# EasyEDA Pro project lune-v6-rev3.2.eprj, board PCB1_1
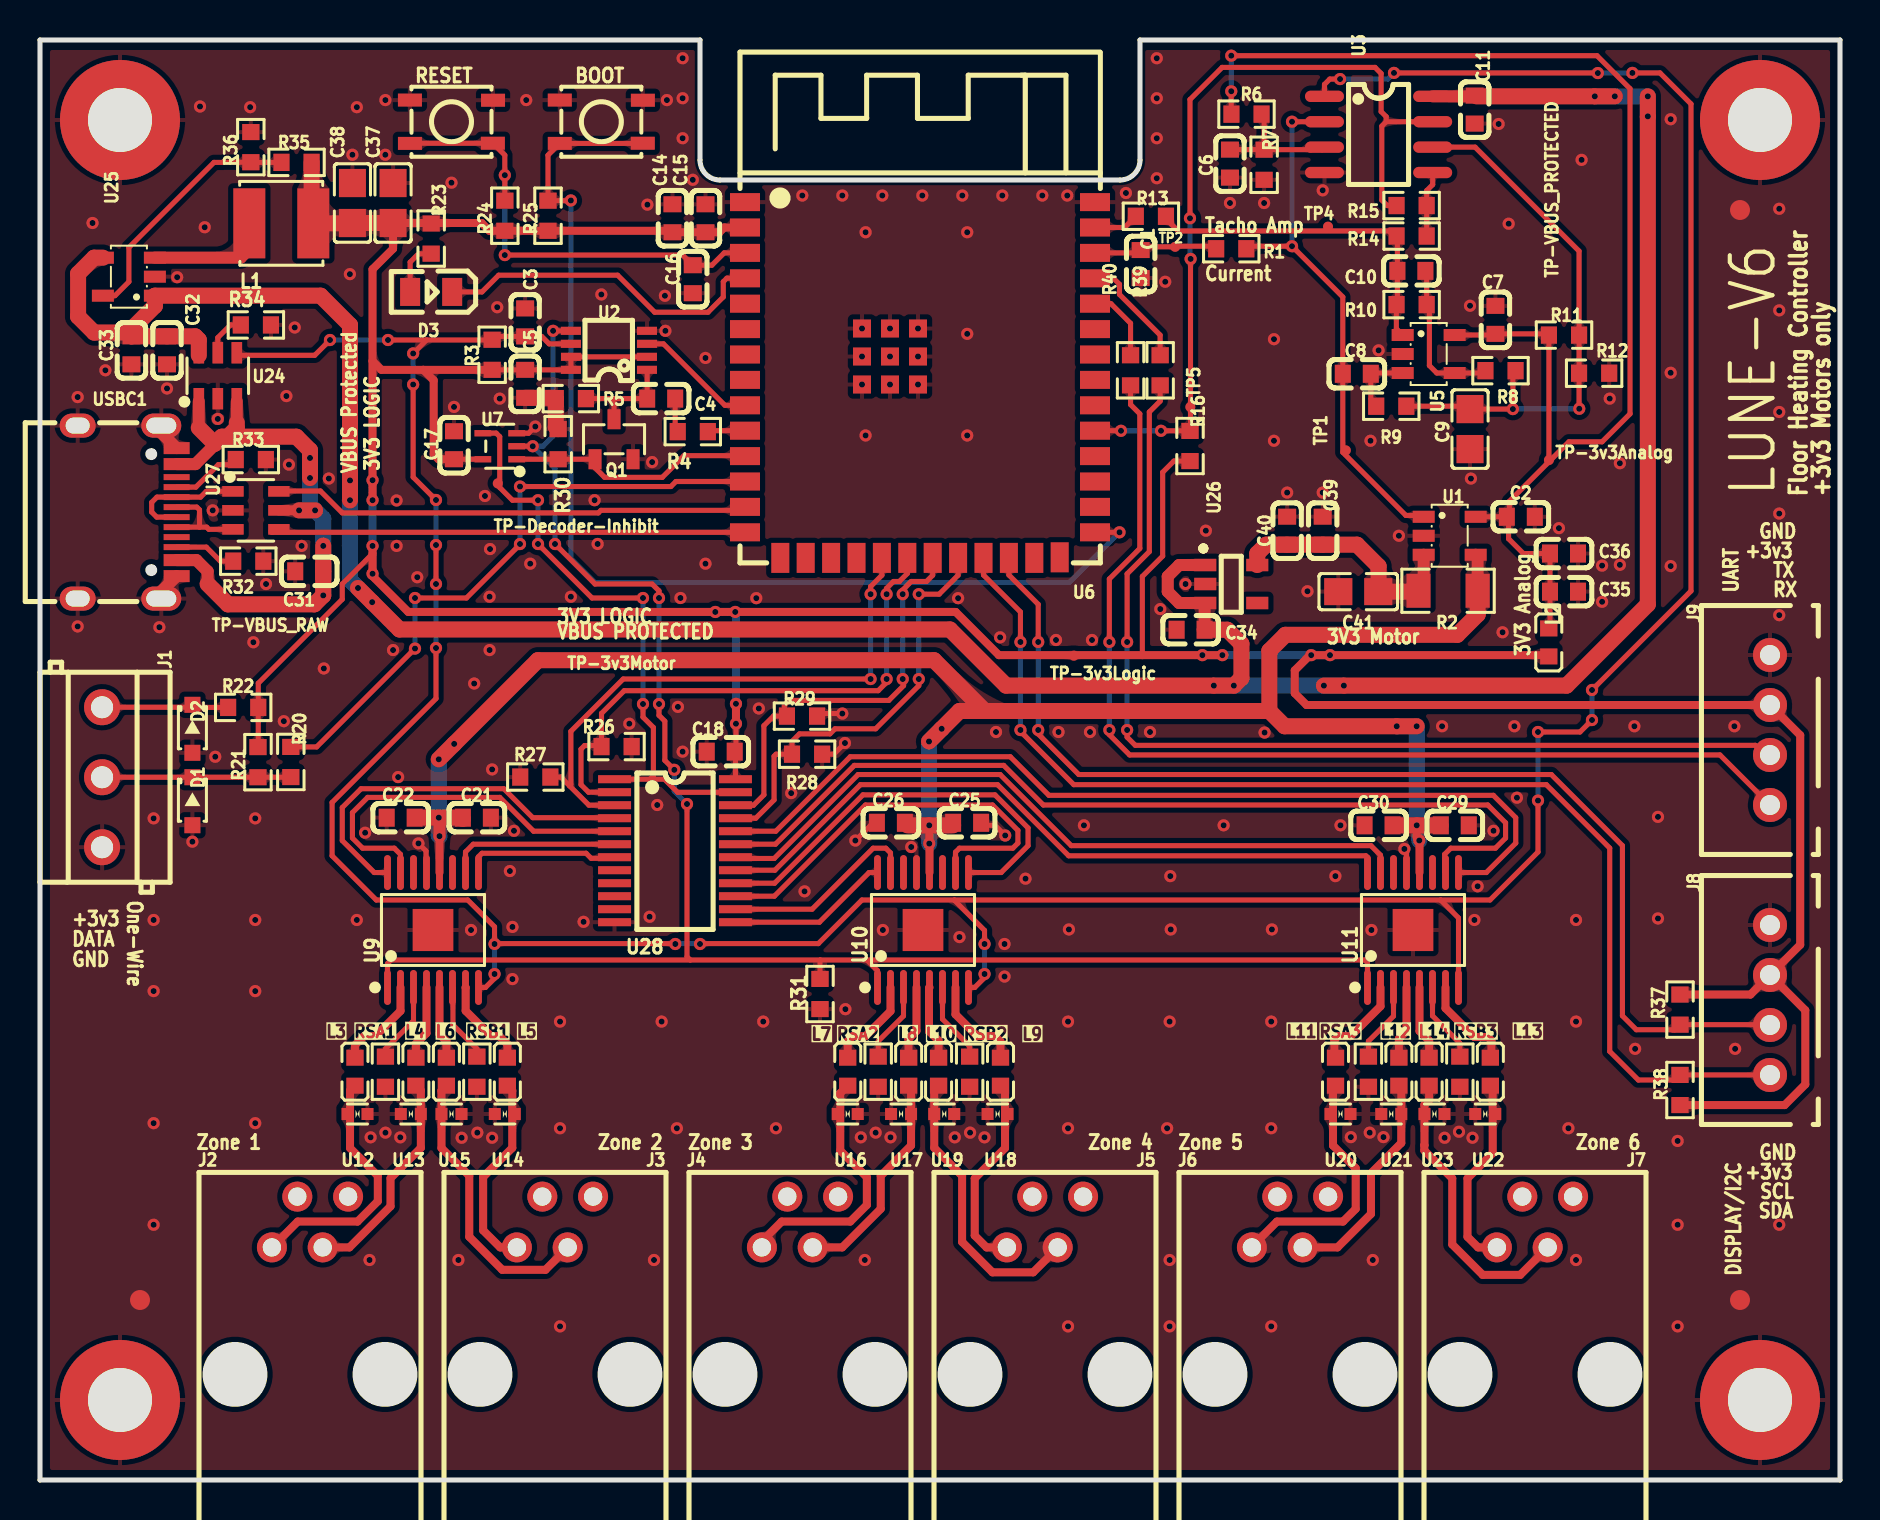
[diagram p5: board, top side]
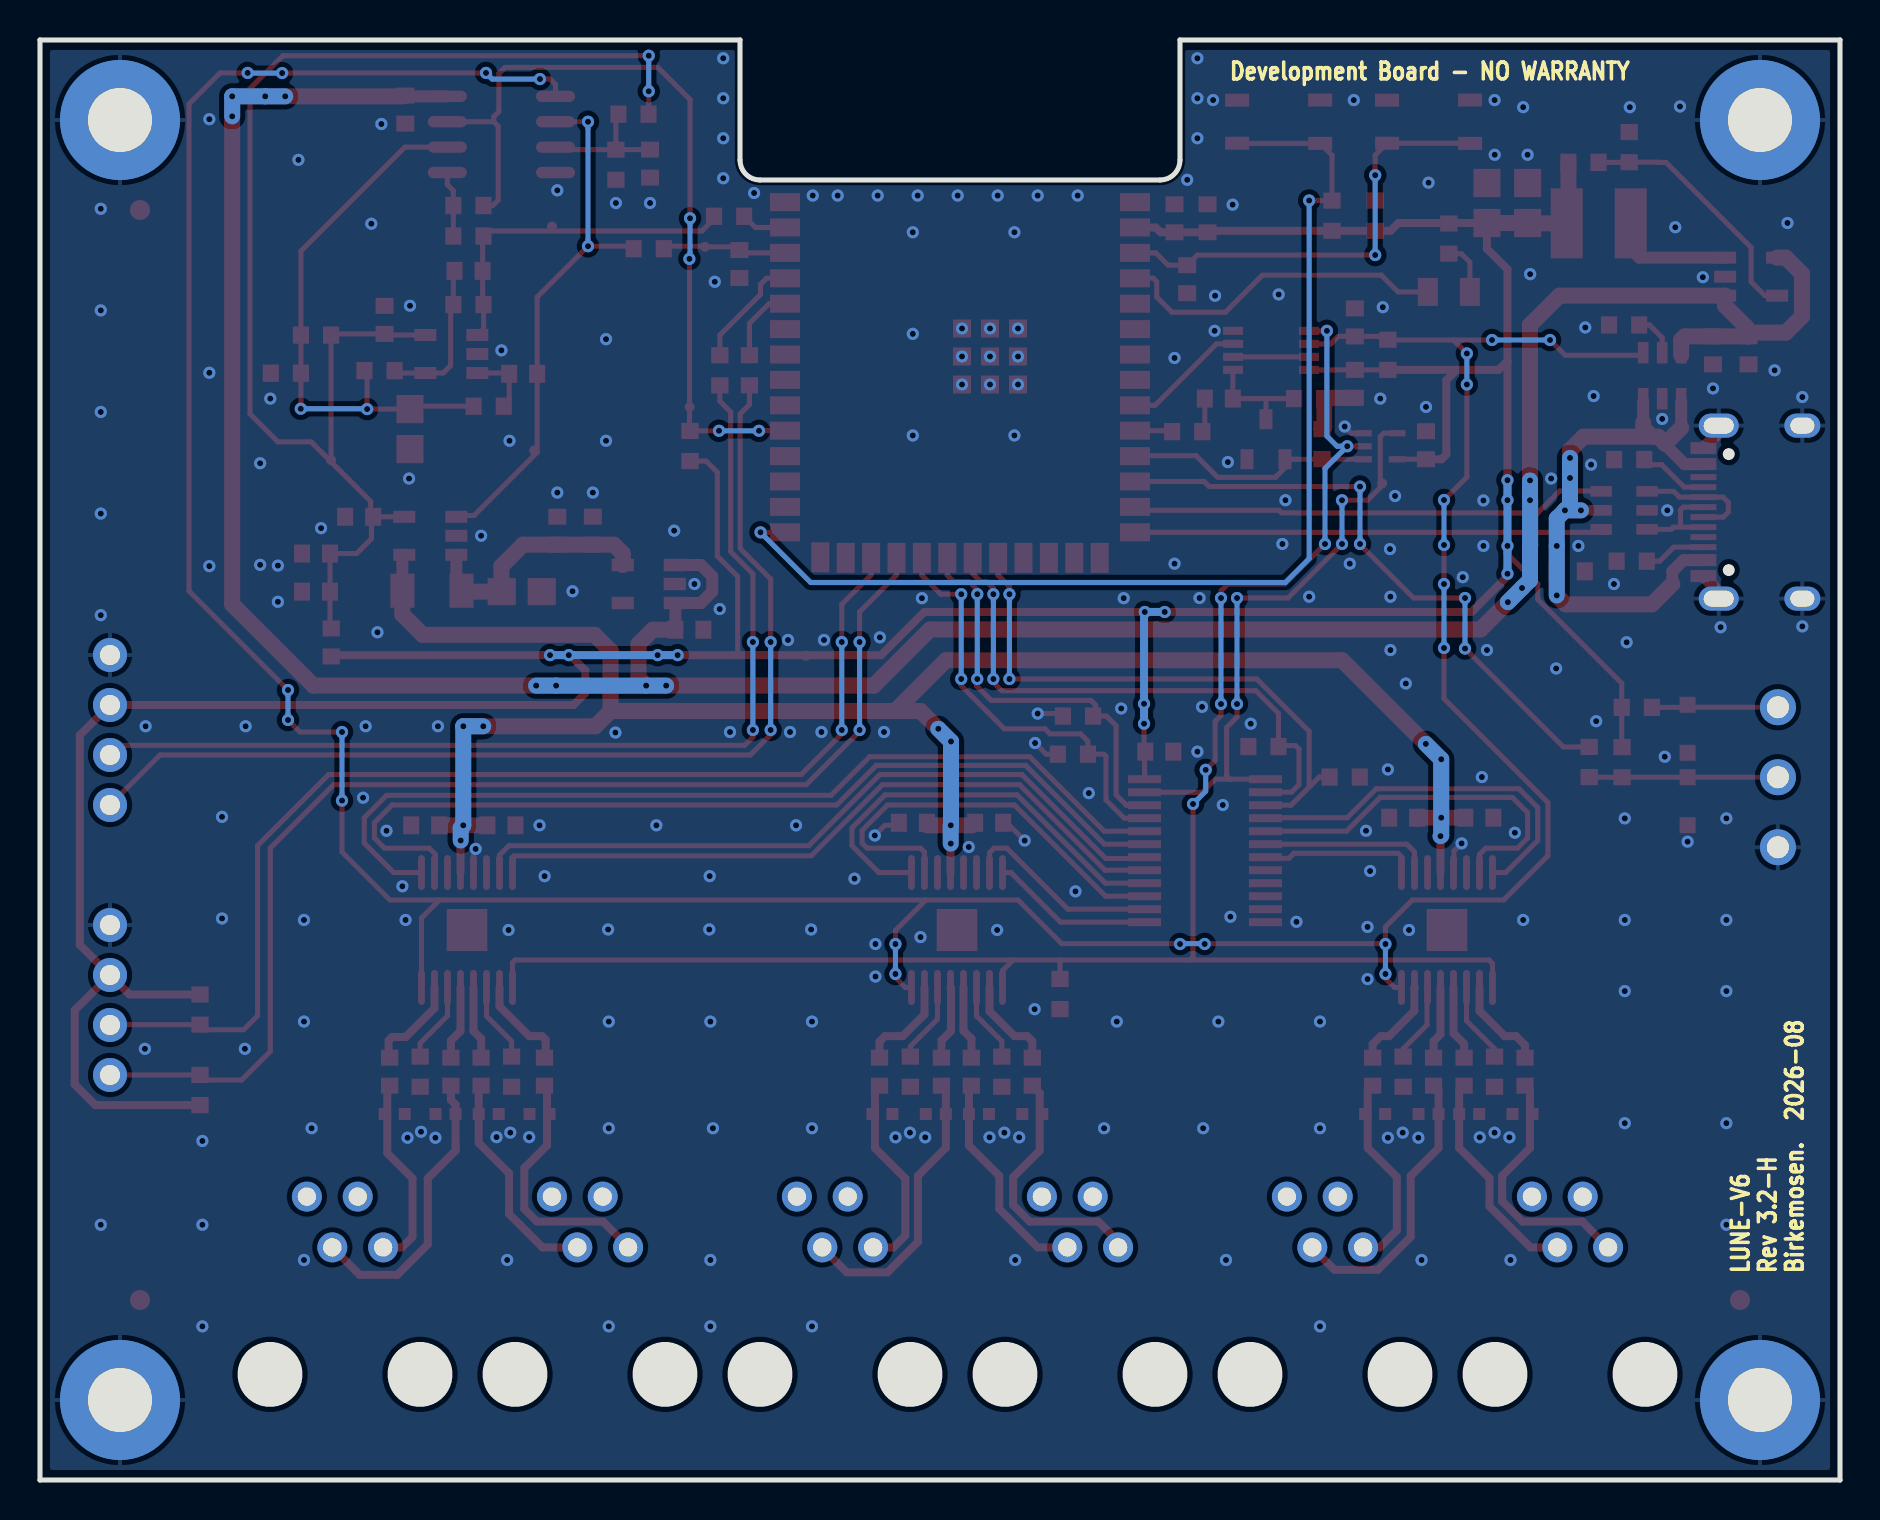
[diagram p6: board, bottom side, seen from below]

Outline 90 x 72 mm; copper layers: Top Layer, Bottom Layer. Coordinates in mm from the lower left corner of the outline.
Outline path: 0,72 33,72 33,66 arc(33.29,65.29) 34,65 54,65 arc(54.71,65.29) 55,66 55,72 90,72 90,0 0,0 0,72
Stack: Top Layer 0.035mm / Dielectric1 1.51mm FR4 er 4.5 / Bottom Layer 0.035mm

## Design rules (mm)
template: JLCPCB Capability(Two Layers Board)
spacing copperThickness1oz (default): track to track 0.102, other pairs 0.152 to 0.3
spacing copperThickness2oz: track to track 0.203, other pairs 0.152 to 0.3
track width copperThickness1oz (default): min 0.127, default 0.254, max 2.54
track width copperThickness2oz: min 0.203, default 0.254, max 2.54
differential pair differentialPair (default): width min 0.127, default 0.254, max 2.54; gap min 0.152, default 0.152
via viaSize (default): diameter min 0.5, default 0.61, max 10; hole min 0.3, default 0.305, max 6.3

## Placement (name value [footprint] x y rotation side)
BOOT  PTS810SJG250SMTRLFS  [SW-SMD_4P_PTS810SJM250SMTRLFS]  28.07 67.91 0 top
C1  100nF  [C0603]  55.03 60.8 90 top
C2  100nF  [C0603]  74.04 48.16 0 top
C3  100nF  [C0603]  24.26 57.88 90 top
C4  10nF  [C0603]  31.06 54.07 0 top
C5  100nF  [C0603]  24.26 54.81 270 top
C6  100nF  [C0603]  59.5 65.82 90 top
C7  100nF  [C0603]  72.77 58.01 270 top
C8  1uF  [C0603]  65.84 55.31 180 top
C9  22uF  [C0805]  71.5 52.55 90 top
C10  4.7nF  [C0603]  68.57 60.46 180 top
C11  100nF  [C0603]  71.74 68.52 270 top
C14  10uF  [C0603]  31.62 63.09 270 top
C15  100nF  [C0603]  33.27 63.09 270 top
C16  1uF  [C0603]  32.64 60.04 90 top
C17  100nF  [C0603]  20.7 51.74 90 top
C18  100nF  [C0603]  34.04 36.42 0 top
C21  100nF  [C0603]  21.84 33.11 180 top
C22  10uF  [C0603]  18.03 33.11 0 top
C25  100nF  [C0603]  46.35 32.86 180 top
C26  10uF  [C0603]  42.54 32.86 0 top
C29  100nF  [C0603]  70.74 32.73 180 top
C30  10uF  [C0603]  66.93 32.73 0 top
C31  1uF  [C0603]  13.46 45.43 0 top
C32  10uF  [C0603]  6.35 56.48 90 top
C33  100nF  [C0603]  4.57 56.48 90 top
C34  10uF  [C0603]  57.53 42.51 0 top
C35  10uF  [C0603]  76.2 44.42 0 top
C36  100nF  [C0603]  76.2 46.32 180 top
C37  22uF  [C0805]  17.65 63.85 270 top
C38  22uF  [C0805]  15.62 63.85 270 top
C39  10uF  [C0603]  64.13 47.47 270 top
C40  100nF  [C0603]  62.36 47.47 270 top
C41  22uF  [C0805]  65.91 44.42 0 top
D1  PESD3V3U1UA,115  [SOD-323_L1.7-W1.3-LS2.5-RD]  7.62 33.94 270 top
D2  PESD3V3U1UA,115  [SOD-323_L1.7-W1.3-LS2.5-RD]  7.62 37.56 270 top
D3  KT-0805G  [LED0805-R-RD]  19.56 59.4 180 top
J1  DB301V-3.5-3P-GN-S  [CONN-TH_DB301V-3.5-3P-GN]  3.1 35.14 270 top
J2  5301-4P4C  [RJ11-TH_RJ11-4P4C]  13.5 12.9 0 top
J3  5301-4P4C  [RJ11-TH_RJ11-4P4C]  25.75 12.9 0 top
J4  5301-4P4C  [RJ11-TH_RJ11-4P4C]  38 12.9 0 top
J5  5301-4P4C  [RJ11-TH_RJ11-4P4C]  50.25 12.9 0 top
J6  5301-4P4C  [RJ11-TH_RJ11-4P4C]  62.5 12.9 0 top
J7  5301-4P4C  [RJ11-TH_RJ11-4P4C]  74.75 12.9 0 top
J8  B4B-XH-A(LF)(SN)  [CONN-TH_B4B-XH-A-LF-SN]  86.5 24 90 top
J9  B4B-XH-A(LF)(SN)  [CONN-TH_B4B-XH-A-LF-SN]  86.5 37.5 90 top
L1  2.2uH  [IND-SMD_L4.0-W4.0]  12.06 62.83 180 top
L2  GZ1608D601TF  [L0603]  75.44 41.88 270 top
L3  GZ1608D601TF  [L0603]  15.75 20.42 270 top
L4  GZ1608D601TF  [L0603]  18.8 20.42 270 top
L5  GZ1608D601TF  [L0603]  23.37 20.42 270 top
L6  GZ1608D601TF  [L0603]  20.32 20.42 270 top
L7  GZ1608D601TF  [L0603]  40.39 20.42 270 top
L8  GZ1608D601TF  [L0603]  43.43 20.42 270 top
L9  GZ1608D601TF  [L0603]  48.03 20.42 270 top
L10  GZ1608D601TF  [L0603]  44.93 20.42 270 top
L11  GZ1608D601TF  [L0603]  64.78 20.42 270 top
L12  GZ1608D601TF  [L0603]  67.94 20.42 270 top
L13  GZ1608D601TF  [L0603]  72.52 20.42 270 top
L14  GZ1608D601TF  [L0603]  69.46 20.42 270 top
NOREF  -  [Pad_e152]  4 4 0 top
NOREF#2  -  [Pad_e53873]  85 63.5 0 top
NOREF#3  -  [Pad_e149]  4 68 0 top
NOREF#4  -  [Pad_e53874]  85 9 0 top
NOREF#5  -  [Pad_e53871]  5 9 0 top
NOREF#6  -  [Pad_e153]  86 4 0 top
NOREF#7  -  [Pad_e151]  86 68 0 top
Q1  2N7002  [SOT-23-3_L2.9-W1.3-P1.90-LS2.4-BR]  28.7 52.04 270 top
R1  1kΩ  [R0603]  59.56 61.56 0 top
R2  500mΩ  [R1206]  70.4 44.46 0 top
R3  10kΩ  [R0603]  22.61 56.26 270 top
R4  1kΩ  [R0603]  32.64 52.42 0 top
R5  100kΩ  [R0603]  26.54 54.07 0 top
R6  10kΩ  [R0603]  60.32 68.29 180 top
R7  56kΩ  [R0603]  61.21 65.76 90 top
R8  1kΩ  [R0603]  73.03 55.47 180 top
R9  100kΩ  [R0603]  67.56 53.69 0 top
R10  100kΩ  [R0603]  68.58 58.77 0 top
R11  1kΩ  [R0603]  76.2 57.25 0 top
R12  1kΩ  [R0603]  77.71 55.34 0 top
R13  1kΩ  [R0603]  55.54 63.19 0 top
R14  4.7kΩ  [R0603]  68.58 62.2 0 top
R15  100kΩ  [R0603]  68.58 63.72 180 top
R16  10kΩ  [R0603]  57.5 51.7 90 top
R20  33Ω  [R0603]  12.54 35.9 90 top
R21  4.7kΩ  [R0603]  10.9 35.89 90 top
R22  33Ω  [R0603]  10.16 38.63 0 top
R23  1kΩ  [R0603]  19.56 62.07 90 top
R24  10kΩ  [R0603]  23.24 63.21 270 top
R25  10kΩ  [R0603]  25.4 63.21 270 top
R26  100kΩ  [R0603]  28.83 36.67 180 top
R27  100kΩ  [R0603]  24.77 35.15 0 top
R28  100kΩ  [R0603]  38.35 36.29 180 top
R29  100kΩ  [R0603]  38.1 38.19 180 top
R30  100kΩ  [R0603]  25.91 51.79 270 top
R31  100kΩ  [R0603]  39 24.3 90 top
R32  5.1kΩ  [R0603]  10.41 45.94 0 top
R33  5.1kΩ  [R0603]  10.54 51.02 0 top
R34  23.7kΩ  [R0603]  10.8 57.75 0 top
R35  453kΩ  [R0603]  12.83 65.88 180 top
R36  100kΩ  [R0603]  10.54 66.64 90 top
R37  4.7kΩ  [R0603]  82 23.52 270 top
R38  4.7kΩ  [R0603]  82 19.5 270 top
R39  1kΩ  [R0603]  56.01 55.48 270 top
R40  1kΩ  [R0603]  54.53 55.48 270 top
RESET  PTS810SJG250SMTRLFS  [SW-SMD_4P_PTS810SJM250SMTRLFS]  20.57 67.91 0 top
RSA1  1Ω  [R0603]  17.27 20.42 90 top
RSA2  1Ω  [R0603]  41.91 20.42 90 top
RSA3  1Ω  [R0603]  66.42 20.42 90 top
RSB1  1Ω  [R0603]  21.84 20.42 90 top
RSB2  1Ω  [R0603]  46.48 20.42 90 top
RSB3  1Ω  [R0603]  70.99 20.42 90 top
TP1  CURRENT_RAW  [Test-Point-0.5mm]  65.29 51.48 90 top
TP2  ADC_CURRENT  [Test-Point-0.5mm]  56.76 61.66 0 top
TP4  TACHO_AMP  [Test-Point-0.5mm]  64.4 62.67 270 top
TP5  -  [Test-Point-0.5mm]  57.52 53.65 180 top
TP-3v3Analog  PWR_FLAG  [Test-Point-0.5mm]  75.45 51 90 top
TP-3v3Logic  PWR_FLAG  [Test-Point-0.5mm]  51.69 41.22 180 top
TP-3v3Motor  PWR_FLAG  [Test-Point-0.5mm]  25.8 40.93 180 top
TP-Decoder-Inhibit  -  [Test-Point-0.5mm]  22.89 49.83 0 top
TP-VBUS_PROTECTED  PWR_FLAG  [Test-Point-0.5mm]  76.29 69.17 270 top
TP-VBUS_RAW  PWR_FLAG  [Test-Point-0.5mm]  9.44 43.8 270 top
U1  INA180A1IDBVR  [SOT-23-5_L3.0-W1.7-P0.95-LS2.8-BR]  70.49 47.21 180 top
U2  74LVC1G74DP,125  [TSSOP-8_L3.0-W3.0-P0.65-LS4.0-BL]  28.45 56.48 90 top
U3  LMV393IDR  [SOIC-8_L5.0-W4.0-P1.27-LS6.0-BL]  66.93 67.28 270 top
U5  TLV9001IDBVR  [SOT-23-5_L3.0-W1.7-P0.95-LS2.8-BR]  69.43 56.3 180 top
U6  2.4GHz  [WIRELM-SMD_ESP32-S3-WROOM-1]  44 55 0 top
U7  SN74LVC1G00DCKR  [SOT-353_L2.1-W1.3-P0.65-LS2.3-BR]  22.99 51.69 0 top
U9  DRV8411PWPR  [HTSSOP-16_L5.0-W4.4-P0.65-LS6.4-TL-EP-1]  19.65 27.5 90 top
U10  DRV8411PWPR  [HTSSOP-16_L5.0-W4.4-P0.65-LS6.4-TL-EP-1]  44.15 27.5 90 top
U11  DRV8411PWPR  [HTSSOP-16_L5.0-W4.4-P0.65-LS6.4-TL-EP-1]  68.65 27.5 90 top
U12  TPD1E10B06DPYR  [X1SON-2_L1.0-W0.6-P0.65-BI-1]  15.88 18.3 0 top
U13  TPD1E10B06DPYR  [X1SON-2_L1.0-W0.6-P0.65-BI-1]  18.54 18.3 180 top
U14  TPD1E10B06DPYR  [X1SON-2_L1.0-W0.6-P0.65-BI-1]  23.24 18.3 180 top
U15  TPD1E10B06DPYR  [X1SON-2_L1.0-W0.6-P0.65-BI-1]  20.57 18.3 0 top
U16  TPD1E10B06DPYR  [X1SON-2_L1.0-W0.6-P0.65-BI-1]  40.39 18.3 0 top
U17  TPD1E10B06DPYR  [X1SON-2_L1.0-W0.6-P0.65-BI-1]  43.05 18.3 180 top
U18  TPD1E10B06DPYR  [X1SON-2_L1.0-W0.6-P0.65-BI-1]  47.88 18.3 180 top
U19  TPD1E10B06DPYR  [X1SON-2_L1.0-W0.6-P0.65-BI-1]  45.21 18.3 0 top
U20  TPD1E10B06DPYR  [X1SON-2_L1.0-W0.6-P0.65-BI-1]  65.02 18.3 0 top
U21  TPD1E10B06DPYR  [X1SON-2_L1.0-W0.6-P0.65-BI-1]  67.56 18.3 180 top
U22  TPD1E10B06DPYR  [X1SON-2_L1.0-W0.6-P0.65-BI-1]  72.26 18.3 180 top
U23  TPD1E10B06DPYR  [X1SON-2_L1.0-W0.6-P0.65-BI-1]  69.72 18.3 0 top
U24  TPS2553DBVR-1  [SOT-23-6_L2.9-W1.6-P0.95-LS2.8-BL]  8.89 55.21 0 top
U25  SY8089AAAC  [SOT-23-5_L3.0-W1.7-P0.95-LS2.8-BR]  4.44 60.17 0 top
U26  AP2112K-3.3TRG1  [SOT-25-5_L2.9-W1.6-P0.95-LS2.8-BL]  59.56 44.8 270 top
U27  USBLC6-2SC6  [SOT-23-6_L2.9-W1.6-P0.95-LS2.8-BL]  10.8 48.48 270 top
U28  74HC4514PW,118  [TSSOP-24_L7.8-W4.4-P0.65-LS6.4-BL]  31.75 31.46 270 top
USBC1  TYPE-C-31-M-12  [USB-C_SMD-TYPE-C-31-M-12_1]  4.36 48.39 270 top

## Footprints (pads in the part's own frame, mm; a bottom-side part is the same pattern mirrored in y, then rotated)
C0603
  rect 0.8x0.9 smd: 1(-0.7,0) 2(0.7,0)
C0805
  rect 1.41x1.35 smd: 1(-1,0) 2(1,0)
CONN-TH_B4B-XH-A-LF-SN
  round 1.7 hole 1: 1(3.75,0) 2(1.25,0) 3(-1.25,0) 4(-3.75,0)
CONN-TH_DB301V-3.5-3P-GN
  round 1.8 hole 1.1: 1(-3.5,0) 2(0,0) 3(3.5,0)
HTSSOP-16_L5.0-W4.4-P0.65-LS6.4-TL-EP-1
  oval 1.747x0.343 smd: 1(-2.873,2.275) 2(-2.873,1.625) 3(-2.873,0.975) 4(-2.873,0.325) 5(-2.873,-0.325) 6(-2.873,-0.975) 7(-2.873,-1.625) 8(-2.873,-2.275) 9(2.873,-2.275) 10(2.873,-1.625) 11(2.873,-0.975) 12(2.873,-0.325) 13(2.873,0.325) 14(2.873,0.975) 15(2.873,1.625) 16(2.873,2.275)
  rect 2.105x2.03 smd: 17(0,0)
IND-SMD_L4.0-W4.0
  rect 1.6x3.5 smd: 1(-1.6,0) 2(1.6,0)
L0603
  rect 0.8x0.864 smd: 1(-0.7,0) 2(0.7,0)
LED0805-R-RD
  rect 1x1.399 smd: 1(1.05,0) 2(-1.05,0)
Pad_e149
  round 6 hole 3.2: 1(0,0)
Pad_e151
  round 6 hole 3.2: 1(0,0)
Pad_e152
  round 6 hole 3.2: 1(0,0)
Pad_e153
  round 6 hole 3.2: 1(0,0)
Pad_e53871
  round 1 smd: 1(0,0)
Pad_e53873
  round 1 smd: 1(0,0)
Pad_e53874
  round 1 smd: 1(0,0)
R0603
  rect 0.806x0.864 smd: 1(-0.753,0) 2(0.753,0)
R1206
  rect 1.208x1.701 smd: 1(-1.479,0) 2(1.479,0)
RJ11-TH_RJ11-4P4C
  round 1.498 hole 0.914: 1(-1.905,-1.27) 2(-0.635,1.27) 3(0.635,-1.27) 4(1.905,1.27)
SOD-323_L1.7-W1.3-LS2.5-RD
  rect 0.8x0.8 smd: 1(-1.2,0) 2(1.2,0)
SOIC-8_L5.0-W4.0-P1.27-LS6.0-BL
  oval 0.569x1.95 smd: 1(-1.905,-2.705) 2(-0.635,-2.705) 3(0.635,-2.705) 4(1.905,-2.705) 5(1.905,2.705) 6(0.635,2.705) 7(-0.635,2.705) 8(-1.905,2.705)
SOT-23-3_L2.9-W1.3-P1.90-LS2.4-BR
  rect 1x0.65 smd: 1(1,-0.95) 2(1,0.95) 3(-1,0)
SOT-23-5_L3.0-W1.7-P0.95-LS2.8-BR
  rect 1.1x0.6 smd: 1(1.3,-0.95) 2(1.3,0) 3(1.3,0.95) 4(-1.3,0.95) 5(-1.3,-0.95)
SOT-23-6_L2.9-W1.6-P0.95-LS2.8-BL
  rect 0.532x1.072 smd: 1(-0.95,-1.149) 2(0,-1.149) 3(0.95,-1.149) 4(0.95,1.149) 5(0,1.149) 6(-0.95,1.149)
SOT-25-5_L2.9-W1.6-P0.95-LS2.8-BL
  rect 0.623x1.105 smd: 1(-0.95,-1.3) 2(-0.001,-1.3) 3(0.95,-1.3) 4(0.95,1.3) 5(-0.95,1.3)
SOT-353_L2.1-W1.3-P0.65-LS2.3-BR
  rect 0.839x0.315 smd: 1(0.845,-0.65) 2(0.845,0) 3(0.845,0.65) 4(-0.845,0.65) 5(-0.845,-0.65)
SW-SMD_4P_PTS810SJM250SMTRLFS
  rect 1.2x0.65 smd: 1(-2.078,1.083) 2(2.078,1.075) 3(-2.077,-1.083) 4(2.071,-1.075)
Test-Point-0.5mm
  round 0.5 smd: 1(0,0)
TSSOP-8_L3.0-W3.0-P0.65-LS4.0-BL
  rect 0.406x1 smd: 1(-0.975,-1.9) 2(-0.325,-1.9) 3(0.325,-1.9) 4(0.975,-1.9) 5(0.975,1.9) 6(0.325,1.9) 7(-0.325,1.9) 8(-0.975,1.9)
TSSOP-24_L7.8-W4.4-P0.65-LS6.4-BL
  rect 0.4x1.65 smd: 1(-3.575,-3.022) 2(-2.925,-3.022) 3(-2.275,-3.022) 4(-1.625,-3.022) 5(-0.975,-3.022) 6(-0.325,-3.022) 7(0.325,-3.022) 8(0.975,-3.022) 9(1.625,-3.022) 10(2.275,-3.022) 11(2.925,-3.022) 12(3.575,-3.022) 13(3.575,3.022) 14(2.925,3.022) 15(2.275,3.022) 16(1.625,3.022) 17(0.975,3.022) 18(0.325,3.022) 19(-0.325,3.022) 20(-0.975,3.022) 21(-1.625,3.022) 22(-2.275,3.022) 23(-2.925,3.022) 24(-3.575,3.022)
USB-C_SMD-TYPE-C-31-M-12_1
  oval 1.2x2 hole 0.8x1.5: 1(4.325,1.706) 4(-4.325,1.706)
  oval 1.2x1.8 hole 0.8x1.2: 2(4.325,-2.474) 3(-4.325,-2.474)
  custom 0.6x1.3 smd: A1B12(-3.2,2.474) A4B9(-2.4,2.474) B1A12(3.2,2.474) B4A9(2.401,2.474)
  rect 0.3x1.3 smd: A5(-1.25,2.474) A6(-0.25,2.474) A7(0.25,2.474) A8(1.25,2.474) B5(1.75,2.474) B6(0.75,2.474) B7(-0.75,2.474) B8(-1.75,2.474)
WIRELM-SMD_ESP32-S3-WROOM-1
  rect 1.5x0.9 smd: 1(-8.75,8.895) 2(-8.75,7.625) 3(-8.75,6.355) 4(-8.75,5.085) 5(-8.75,3.815) 6(-8.75,2.545) 7(-8.75,1.275) 8(-8.75,0.005) 9(-8.75,-1.265) 10(-8.75,-2.535) 11(-8.75,-3.805) 12(-8.75,-5.075) 13(-8.75,-6.345) 14(-8.75,-7.615) 27(8.75,-7.615) 28(8.75,-6.345) 29(8.75,-5.075) 30(8.75,-3.805) 31(8.75,-2.535) 32(8.75,-1.265) 33(8.75,0.005) 34(8.75,1.275) 35(8.75,2.545) 36(8.75,3.815) 37(8.75,5.085) 38(8.75,6.355) 39(8.75,7.625) 40(8.75,8.895)
  rect 0.9x1.5 smd: 15(-6.985,-8.895) 16(-5.715,-8.895) 17(-4.445,-8.895) 18(-3.175,-8.895) 19(-1.905,-8.895) 20(-0.635,-8.895) 21(0.635,-8.895) 22(1.905,-8.895) 23(3.175,-8.895) 24(4.445,-8.895) 25(5.715,-8.895) 26(6.985,-8.865)
  rect 0.9x0.9 smd: 41(-2.9,2.575) 41(-2.9,1.175) 41(-2.9,-0.225) 41(-1.5,2.575) 41(-1.5,1.175) 41(-1.5,-0.225) 41(-0.1,2.575) 41(-0.1,1.175) 41(-0.1,-0.225)
X1SON-2_L1.0-W0.6-P0.65-BI-1
  rect 0.6x0.6 smd: 1(-0.5,0) 2(0.5,0)

## Nets
As in the schematic, except:
GND: BOOT.1 BOOT.2 C1.1 C2.2 C3.2 C5.2 C6.1 C7.1 C9.1 C11.2 C14.1 C15.1 C16.1 C17.2 C18.1 C21.1 C22.1 C25.1 C26.1 C29.1 C30.1 C31.1 C32.1 C33.1 C34.1 C35.2 C36.1 C37.1 C38.1 C39.1 C40.1 C41.1 D1.2 D2.2 J1.3 J8.1 J9.1 NOREF.1 NOREF#2.1 NOREF#3.1 NOREF#4.1 NOREF#5.1 NOREF#6.1 NOREF#7.1 Q1.2 R5.1 R7.1 R12.2 R26.1 R27.1 R28.1 R29.1 R30.1 R31.1 R32.2 R33.2 R34.2 R36.2 RESET.1 RESET.2 RSA1.1 RSA2.1 RSA3.1 RSB1.1 RSB2.1 RSB3.1 U1.2 U2.4 U3.4 U5.2 U6.1 U6.40 U6.41 U7.3 U9.13 U9.17 U10.13 U10.17 U11.13 U11.17 U12.2 U13.2 U14.2 U15.2 U16.2 U17.2 U18.2 U19.2 U20.2 U21.2 U22.2 U23.2 U24.2 U25.2 U26.2 U27.2 U28.12 USBC1.1 USBC1.2 USBC1.3 USBC1.4 USBC1.A1B12 USBC1.B1A12

Pads without a net: J2 2 4; J3 2 4; J4 2 4; J5 2 4; J6 2 4; J7 2 4; U6 5 6 7 8 15 16 17 18 25 26 28 29 30 32 33 34 35; U9 11 14; U10 11 14; U11 11 14; U26 4; U28 8 9 10 11; USBC1 A8 B8

## Via types
v1: diameter 0.61, hole 0.305, Top Layer to Bottom Layer, 350 vias

## Routing (per net, layer and track width the routed paths; a pad name or vN(x,y) marks a point on that pad's centre or on a via; arc(x,y) is an arc through that point)
3V3_ANALOG: length 68.4
  Top Layer w0.254: v1(59.56,69.44) 59.56,68.3 R6.2 ; v1(59.56,71.22) 77.85,71.22 79.5,69.56 79.5,53.31 78.1,51.91 76.45,51.91 75.45,50.91 ; 75.45,50.91 R11.1 75.43,57.25 75.37,57.31 C7.2 72.71,57.25 70.73,57.25 ; 75.45,50.91 73.47,48.93 73.47,48.23 73.4,48.16 ; 73.4,48.16 71.78,48.16 ; 73.4,48.16 73.43,48.14 73.43,47.06 74.17,46.32 C36.2 C35.1 75.5,42.64 L2.1
  Bottom Layer w0.254: v1(59.56,71.22) v1(59.56,69.44)
3V3_EXT: length 6.3
  Top Layer w0.254: R22.1 7.6,38.63 7.59,38.64 J1.1
3V3_LOGIC: length 222
  Top Layer w0.254: v1(34.8,37.81) 34.8,36.48 C18.2 34.77,36.38 U28.24 ; U2.2 U2.7 U2.8 C5.1 R3.2 ; 22.4,51.04 C17.1 ; R16.1 56.69,50.95 56.13,50.39 56.13,46.2 55.12,45.18 55.12,41.24 ; 10.9,36.64 10.91,36.66 R22.2 10.91,39.84 15.11,44.04 15.11,44.8 16.63,46.31
  Top Layer w0.4: J8.2 88.01,26.76 88.01,37.24 J9.2 63.33,38.75 62.74,39.34 62.74,40.48 63.5,41.24 ; J8.2 88.26,23.48 88.26,19.78 87.23,18.75 R38.2 ; J8.2 85.52,24.27 R37.1 ; 16.63,55.95 17.07,55.51 19.16,55.51 ; 16.63,55.95 v1(16.63,49.99) v1(16.63,48.99) ; 16.63,55.95 16.63,60.54 17.65,61.56 17.65,62.83 17.67,62.85 22.08,62.85 22.47,62.46 R24.2 R25.2 31.55,62.46 C14.2 C15.2 33.97,62.39 34.21,62.62 U6.2 ; 19.16,55.51 19.69,54.98 19.69,51.28 19.92,51.04 C17.1 ; 19.16,55.51 R3.2 ; v1(16.63,46.7) 16.63,45.19 18.42,43.4 v1(33.76,43.4) v1(34.76,43.4) 45.78,43.4 47.94,41.24 v1(58.12,41.24) v1(59.12,41.24) ; 75.44,41.31 75.38,41.24 v1(64.5,41.24) v1(63.56,41.24) ; v1(34.8,37.81) v1(34.8,38.81)
  Top Layer w0.8: R35.1 13.58,62.92 L1.1 15.61,62.83 C38.2 C37.2
  Bottom Layer w0.4: v1(16.63,45.31) v1(16.63,46.7) v1(16.63,48.99) v1(16.63,49.99) ; v1(64.5,41.24) v1(63.56,41.24) v1(59.12,41.24) v1(58.12,41.24) ; v1(33.76,43.4) v1(34.76,43.4) 34.8,43.37 v1(34.8,38.81) v1(34.8,37.81)
3V3_MOTOR: length 104.8
  Top Layer w0.4: U10.12 44.47,31.81 v1(44.46,31.82) v1(44.46,32.73) ; U11.12 68.97,31.96 v1(68.96,31.98) 68.84,32.1 v1(68.84,32.73) ; v1(19.97,32.19) U9.12
  Top Layer w0.6: v1(19.94,33.11) 19.97,33.08 v1(19.97,32.19) ; R2.2 71.88,46.17 71.78,46.26
  Top Layer w0.8: v1(19.94,36.04) v1(20.71,36.81) 24.89,40.99 44.7,40.99 47.24,38.45 ; 21.14,33.05 21.08,33.11 v1(19.94,33.11) 18.86,33.11 ; 47.24,38.45 45.97,38.45 v1(45.09,37.56) v1(44.45,36.92) ; 47.24,38.45 61.47,38.45 62.23,37.69 v1(67.84,37.69) v1(68.83,37.69) ; 67.88,32.73 v1(68.84,32.73) 70.04,32.73 ; R2.2 71.88,43.28 70.87,42.26 62.27,42.26 61.47,41.46 61.47,38.63 ; 43.37,32.73 v1(44.46,32.73) 45.66,32.73
  Bottom Layer w0.8: v1(44.46,31.82) v1(44.46,32.73) 44.45,32.75 v1(44.45,36.92) v1(45.09,37.56) ; v1(19.97,32.19) 19.94,32.23 v1(19.94,33.11) v1(19.94,36.04) v1(20.71,36.81) ; v1(67.84,37.69) v1(68.83,37.69) 68.84,37.68 v1(68.84,32.73) 68.96,32.61 v1(68.96,31.98)
3V3_MOTOR_REG: length 12.4
  Top Layer w0.6: U1.3 69.19,44.72 R2.1
  Top Layer w0.8: 68.88,44.42 C41.2 66.93,44.43 66.93,45.69 65.85,46.77 C39.2 C40.2 61.31,46.77 60.86,46.32 U26.5
GND: length 15.4
  Top Layer w0.254: v1(40.25,36.85) 39.69,36.29 R28.1 ; 47.06,32.73 47.75,32.73 v1(48.26,32.23) ; v1(68.22,31.55) 68.32,31.45 68.32,30.37 ; v1(18.92,31.83) 19.3,31.45 19.3,30.86 19.33,30.84 U9.13 ; v1(24.77,52.67) 24.43,52.34 U7.3 ; 41.84,32.73 41.53,32.73 v1(40.77,31.97) ; v1(40.12,38.32) 38.98,38.32 R29.1
  Top Layer w0.6: USBC1.1 6.06,44.43 USBC1.B1A12 ; USBC1.A1B12 6.06,52.36 USBC1.4
  Top Layer w0.8: R30.1 25.79,52.66 R5.1 25.75,54.11 C5.2
  vias: v1(1.88,54.15) v1(1.88,42.68) v1(2.63,62.85) v1(3.27,55.48) v1(5.68,33.08) v1(5.68,28) v1(5.68,24.45) v1(5.68,17.84) v1(5.68,12.76) v1(5.97,42.64) v1(6.35,54.58) v1(6.86,60.14) v1(7.62,31.92) v1(8,68.67) v1(8.24,62.64) v1(8.64,48.48) v1(8.76,36.16) v1(8.89,53.05) v1(10.51,68.64) v1(10.67,41.89) v1(10.76,33.08) v1(10.76,28) v1(10.76,24.45) v1(10.76,17.84) v1(11.3,44.8) v1(12.19,37.94) v1(12.32,54.2) v1(12.45,50.77) v1(12.74,57.63) v1(13.08,46.7) v1(14.19,40.58) v1(14.44,50.07) v1(15.49,60.29) v1(15.62,66.26) v1(15.84,68.64) v1(15.84,28) v1(16.26,32.36) v1(16.53,17.13) v1(16.48,11) v1(17.27,69) v1(17.27,66.26) v1(17.27,17.37) v1(17.65,41.5) v1(17.83,48.98) v1(17.83,46.7) v1(17.91,35.15) v1(18.01,17.13) v1(18.86,45.14) v1(20.57,64.86) v1(20.7,53.65) v1(20.92,11) v1(21.08,17.11) v1(21.55,27.5) v1(21.71,39.82) v1(21.87,17.37) v1(22.25,49.2) v1(22.5,46.55) v1(22.48,44.16) v1(22.48,41.5) v1(22.61,35.53) v1(22.61,17.11) v1(22.86,58.64) v1(22.99,54.07) v1(23.5,30.45) v1(23.62,27.65) v1(23.62,25.05) v1(23.7,32.46) v1(24.31,69) v1(24.51,45.81) v1(26,22.92) v1(26,17.59) v1(26,7.68) v1(26.54,44.16) v1(27.18,27.91) v1(27.73,48.99) v1(27.88,46.8) v1(28.07,59.28) v1(29.46,37.81) v1(30.37,63.77) v1(30.48,28.16) v1(30.61,50.89) v1(30.7,11) v1(30.86,33.75) v1(31.08,22.92) v1(31.25,59.21) v1(31.35,69) v1(31.27,57.46) v1(31.84,17.59) v1(31.9,38.66) v1(32.02,44.1) v1(32.13,71.09) v1(32.13,69.09) v1(32.13,67.09) v1(32.13,36.42) v1(32.64,65.01) v1(33.27,56.1) v1(33.27,45.81) v1(35.81,44.09) v1(35.94,38.58) v1(36.16,22.92) v1(36.8,17.59) v1(37.56,34.34) v1(38.12,64.22) v1(38.23,29.43) v1(40.12,64.22) v1(40.27,23.54) v1(41.04,17.13) v1(41.1,57.58) v1(41.1,56.17) v1(41.1,54.78) v1(41.24,11) v1(41.28,62.39) v1(41.28,52.23) v1(41.78,17.37) v1(42.12,64.22) v1(42.14,27.5) v1(42.5,57.58) v1(42.5,56.17) v1(42.5,54.78) v1(42.53,17.13) v1(43.56,31.65) v1(43.9,57.58) v1(43.9,56.17) v1(43.9,54.78) v1(44.12,64.22) v1(45.74,17.13) v1(45.91,44.09) v1(45.97,27.15) v1(46.12,64.22) v1(46.36,62.39) v1(46.36,57.31) v1(46.36,52.23) v1(46.5,17.37) v1(47.22,17.13) v1(47.8,37.4) v1(48.01,42.13) v1(48.12,64.22) v1(48.23,26.8) v1(48.23,25.17) v1(49.28,30.07) v1(50.12,64.22) v1(50.8,42) v1(50.93,37.4) v1(51.36,64.22) v1(51.45,27.53) v1(51.4,22.92) v1(51.4,17.59) v1(51.4,7.68) v1(52.2,32.73) v1(52.5,37.4) v1(52.6,42) v1(54.3,64.35) v1(55.5,37.4) v1(55.84,71.09) v1(55.84,69.09) v1(55.84,67.09) v1(55.84,65.09) v1(56.01,43.55) v1(56.26,59.91) v1(56.35,17.59) v1(56.51,30.19) v1(56.54,27.53) v1(56.48,22.92) v1(56.48,11) v1(56.48,7.68) v1(57.28,44.8) v1(58.29,47.47) v1(59.18,32.73) v1(59.5,63.85) v1(61.21,63.85) v1(61.23,37.37) v1(61.59,27.53) v1(61.56,22.92) v1(61.56,17.59) v1(61.56,7.68) v1(61.7,57.04) v1(61.7,51.96) v1(62.36,49.37) v1(63.37,44.44) v1(64.13,64.48) v1(64.13,49.37) v1(64.77,30.19) v1(65.02,32.73) v1(65.54,17.14) v1(66.53,51.96) v1(66.49,17.37) v1(66.57,27.5) v1(66.64,11) v1(66.93,56.48) v1(67.17,17.14) v1(67.94,47.21) v1(70.1,37.69) v1(70.23,17.11) v1(70.95,17.41) v1(71.5,58.71) v1(71.55,50.07) v1(71.62,17.11) v1(71.72,28) v1(71.88,29.69) v1(72.68,32.46) v1(72.93,67.8) v1(73.13,42.39) v1(73.43,62.81) v1(73.72,37.69) v1(73.85,34.11) v1(75.95,47.59) v1(76.42,17.59) v1(76.8,28) v1(76.8,22.92) v1(76.8,11) v1(77.08,66.01) v1(78.1,45.72) v1(78.1,43.91) v1(78.49,54.07) v1(78.99,50.84) v1(78.99,45.76) v1(79.72,37.69) v1(79.76,21.56) v1(80.9,33.16) v1(80.9,28.08) v1(81.53,68.04) v1(81.53,55.36) v1(81.53,45.69) v1(81.88,16.95) v1(81.88,12.76) v1(81.88,7.68) v1(84.72,37.69) v1(84.76,21.56) v1(86.96,63.56) v1(86.96,58.48) v1(86.96,53.4) v1(86.96,48.32) v1(86.96,43.24) v1(86.96,12.76)
VBUS_PROTECTED: length 158.3
  Top Layer w0.254: 71.83,69.18 71.86,69.21
  Top Layer w0.6: C34.2 58.23,43.82 58.26,43.85 56.96,43.85 56.39,44.42 56.39,45.18 56.96,45.75 58.26,45.75 ; U3.8 71.83,69.18
  Top Layer w0.8: v1(15.9,44.6) v1(16.61,43.89) 17.97,42.53 45.5,42.53 48.31,39.72 v1(58.69,39.72) v1(59.69,39.72) 60.07,40.1 60.07,41.8 59.36,42.51 C34.2 ; v1(64.19,39.72) v1(65.19,39.72) 76.33,39.72 80.39,43.78 v1(80.39,69.18) ; U25.4 2.7,61.12 1.91,60.32 1.91,58.17 2.7,57.37 4.38,57.37 C33.2 ; 71.83,69.18 v1(77.74,69.18) v1(78.74,69.18) ; 15.5,48.98 v1(15.5,49.98) 15.5,57.75 14.03,59.22 U25.1 5.75,58.71 4.7,57.66 4.7,57.31 C33.2 ; 7.94,56.23 7.94,57 7.76,57.18 C32.2 C33.2
  Bottom Layer w0.8: v1(16.61,43.89) v1(15.9,44.6) 15.5,45 15.5,46.7 15.49,46.71 15.49,48.98 15.5,48.98 ; v1(65.19,39.72) v1(64.19,39.72) v1(59.69,39.72) v1(58.69,39.72) ; v1(77.74,69.18) v1(78.74,69.18) v1(80.39,69.18) v1(80.39,68.18) ; v1(15.5,49.98) v1(15.5,48.99)
VBUS_RAW: length 34.4
  Top Layer w0.5: v1(12.95,48.48) U27.5
  Top Layer w0.6: 7.94,52.61 7.94,53.94 ; 8.74,51.81 8.74,51.76 7.77,50.79 USBC1.A4B9 ; USBC1.B4A9 7.82,45.99 8.38,45.43 8.38,44.8 ; 9.84,52.86 9.84,53.94
  Top Layer w0.8: v1(12.95,48.48) v1(13.75,48.48) ; v1(13.5,50.1) v1(13.5,51.1) 13.5,51.49 12.82,52.17 9.4,52.17 ; 8.38,44.8 9.4,43.78 13.72,43.78 v1(14.16,44.23) C31.2 14.16,46.72 ; 7.94,52.61 8.74,51.81 9.09,52.17 9.4,52.17 ; 9.84,52.86 9.84,52.61 9.4,52.17
  Bottom Layer w0.8: v1(13.75,48.48) 13.5,48.74 v1(13.5,50.1) v1(13.5,51.1) ; v1(13.75,48.48) 14.16,48.07 v1(14.16,46.7) v1(14.16,44.23) ; v1(13.75,48.48) v1(12.95,48.48)
ADC_CURRENT: length 6.2
  Top Layer w0.254: U6.38 54.89,61.36 C1.2 55.19,61.66 TP2.1 56.79,61.69 58.81,61.69
ADC_TACHO: length 2.3
  Top Layer w0.254: U6.39 54.23,62.62 R13.1
AISEN1: length 4
  Top Layer w0.254: RSA1.2 17.27,21.56 18.67,22.96 U9.3
AISEN3: length 4
  Top Layer w0.254: U10.3 43.18,23.2 41.91,21.94 RSA2.2
AISEN5: length 4
  Top Layer w0.254: RSA3.2 66.42,21.94 67.68,23.19 U11.3
ARM_CLK: length 5.5
  Top Layer w0.254: Q1.3 28.7,54.06 28.69,54.07 ; U2.1 30.36,55.5 C4.1 28.69,54.07 ; R5.2 28.69,54.07
ARM_EDGE_IN: length 1.6
  Top Layer w0.254: 31.76,52.47 C4.2
BISEN2: length 4
  Top Layer w0.254: RSB1.2 21.84,21.56 20.65,22.75 20.65,24.6 U9.6
BISEN4: length 4
  Top Layer w0.254: RSB2.2 46.48,21.69 45.12,23.04 U10.6
BISEN6: length 4
  Top Layer w0.254: RSB3.2 70.99,21.84 69.62,23.21 U11.6
BOOT_N: length 56.5
  Top Layer w0.254: U6.27 v1(53.97,47.39) ; BOOT.4 30.13,66.83 BOOT.3 25.4,66.24 R25.1 26.53,63.97 v1(26.54,63.98)
  Bottom Layer w0.254: v1(53.97,47.39) 51.47,44.88 27.74,44.88 26.54,46.07 v1(26.54,63.98)
COMM_TACHO_N: length 41.4
  Top Layer w0.254: 67.31,67.91 67.31,68.17 67.06,68.42 67.06,70.33 66.75,70.63 59.11,70.63 57.5,69.02 v1(57.5,63.09) ; 67.31,67.91 67.09,67.69 67.09,63.99 67.36,63.72 R15.2 ; 67.31,67.91 69.63,67.91 ; v1(56.05,52.46) 57.53,52.46 57.53,61.05 v1(57.53,61.06) ; v1(54.05,52.46) 54.04,52.47 U6.31
  Bottom Layer w0.254: v1(57.5,63.09) 57.5,61.09 v1(57.53,61.06) ; v1(54.05,52.46) v1(56.05,52.46)
CURRENT_RAW: length 26.9
  Top Layer w0.254: v1(62.6,67.91) 64.22,67.91 ; U1.1 69.12,48.23 68.29,48.23 65.14,51.38 C8.2 65.14,59.15 v1(62.6,61.69) 60.32,61.69
  Bottom Layer w0.254: v1(62.6,61.69) v1(62.6,67.91)
DECODER_INHIBIT: length 29.9
  Top Layer w0.254: U28.23 34.77,34.39 31.88,34.39 31.22,35.04 30.5,35.04 ; v1(30.15,44.1) 27.6,44.1 v1(24.9,46.8) ; v1(30.15,38.8) 30.15,38.14 30.67,37.62 30.67,35.21 30.5,35.04 ; 30.5,35.04 U28.1 ; U7.4 22.15,52.34 22.81,52.34 22.99,52.17 22.99,49.62 23.62,48.99 v1(24.9,48.99)
  Bottom Layer w0.254: v1(24.9,46.8) v1(24.9,48.99) ; v1(30.15,44.1) v1(30.15,38.8)
DRIVER_N_SLEEP: length 92.9
  Top Layer w0.254: U11.1 66.38,25.87 66.24,26 41.34,26 ; 41.34,26 39.01,26 ; 41.34,26 41.88,25.47 U10.1 ; v1(25.75,46.8) 27.75,44.8 30.61,44.8 30.95,44.46 v1(30.95,44.1) ; U7.2 v1(24.64,51.69) ; 39.01,26 39,25.99 R31.2 ; 39.01,26 32.51,26 ; 32.51,26 32.35,26.16 v1(32.35,33.8) ; 32.51,26 17.55,26 17.38,25.82 U9.1 ; v1(31.72,35.51) 31.24,35.98 31.24,37.94 30.95,38.23 v1(30.95,38.8) ; U2.5 v1(25.65,57.46)
  Bottom Layer w0.254: v1(25.65,57.46) 25.65,52.2 25.15,51.69 v1(24.64,51.69) 25.75,50.58 v1(25.75,46.8) ; v1(30.95,38.8) v1(30.95,44.1) ; v1(32.35,33.8) 31.72,34.44 v1(31.72,35.51)
ESP_EN: length 23.7
  Top Layer w0.254: v1(23.24,61.25) 32.13,61.25 C16.2 33.59,60.74 34.21,61.36 U6.3 ; RESET.3 18.51,66.84 RESET.4 23.24,66.24 v1(23.24,65.24) R24.1
  Bottom Layer w0.254: v1(23.24,61.25) 23.24,65.25
FAULT_N_RAW: length 185.1
  Top Layer w0.254: v1(19.8,49) 18.66,50.14 v1(18.66,54.78) ; 45.72,29 45.72,28.99 47.23,27.48 v1(47.23,26.8) ; 45.72,29 70.03,29 ; 45.72,29 41.1,29 38.92,26.82 33,26.82 ; 70.03,29 70.93,28.1 U11.8 ; 70.03,29 72.5,29 74.9,31.4 v1(74.9,33.97) ; v1(77.6,39.5) 82.55,44.45 82.55,68.8 81,70.35 v1(79.62,70.35) ; v1(19.8,41.6) 19.8,39.07 14.61,33.88 14.61,31.21 16.81,29 21.39,29 22.73,27.66 v1(22.73,26.8) 22.75,26.82 31.77,26.82 ; v1(65,70.05) 64.49,70.05 64.22,69.78 U3.1 ; v1(19.8,46.75) v1(19.8,44.8) ; v1(14.5,57) 13.73,56.23 9.84,56.23 ; v1(67.7,70.35) 77.89,70.35 v1(77.89,70.35) ; U10.8 46.74,24.63 47.23,25.12 v1(47.23,25.3) ; v1(74.9,37.4) 77,37.4 v1(77.6,38) ; v1(22.73,25.3) 22.73,25.08 22.27,24.63 21.93,24.63 ; v1(17.4,57) 19.33,57 ; 19.33,57 22.59,57 22.77,57.18 C3.1 25.08,57.18 25.46,56.81 U2.6 ; 19.33,57 v1(18.66,56.33)
  Bottom Layer w0.254: v1(47.23,25.3) v1(47.23,26.8) ; v1(22.73,26.8) v1(22.73,25.3) ; 31.77,26.82 33,26.82 ; v1(77.6,38) v1(77.6,39.5) ; v1(79.62,70.35) 79.61,70.35 v1(77.89,70.35) ; v1(19.8,49) v1(19.8,46.75) ; v1(74.9,33.97) v1(74.9,37.4) ; v1(19.8,44.8) v1(19.8,41.6) ; v1(17.4,57) v1(14.5,57) ; v1(65,70.05) 67.39,70.05 v1(67.7,70.35) ; v1(18.66,56.33) v1(18.66,54.78)
  vias: v1(31.77,26.8) v1(33,26.8)
FLIM_REF: length 6.6
  Top Layer w0.254: R7.2 64.1,66.52 U3.3 ; R7.2 61.21,68.17 R6.1 ; R7.2 61.2,66.52 C6.2
FWD1: length 19.2
  Top Layer w0.254: U28.4 28.6,33.09 28.57,33.11 24.64,33.11 23.19,34.56 16.05,34.56 15.11,33.62 15.11,31.97 16.71,30.37 U9.16
FWD2: length 7.8
  Top Layer w0.254: U28.7 28.67,31.08 27.56,31.08 27.31,31.34 22.1,31.34 21.92,31.16 21.92,30.38 21.92,30.37
FWD3: length 8.1
  Top Layer w0.254: U28.13 38.97,27.89 41.45,30.37 U10.16
FWD4: length 21.6
  Top Layer w0.254: U28.16 36.73,29.84 41.15,34.26 47.75,34.26 49.4,32.6 49.4,31.72 48.06,30.37 U10.9
FWD5: length 35.6
  Top Layer w0.254: U28.17 36.74,30.49 41.02,34.77 47.88,34.77 51.44,31.21 66.29,31.21 66.38,31.13 U11.16
FWD6: length 46.6
  Top Layer w0.254: U11.9 72.31,30.37 73.79,31.84 73.79,33.11 72.67,34.23 50.44,34.23 48.51,36.16 40.51,36.16 36.79,32.44 U28.20
I2C_SCL: length 57.2
  Top Layer w0.254: v1(49.91,41.9) 49.91,43.78 48.44,45.25 U6.24 ; J8.3 86.48,22.77 R37.2 81.75,22.51 79.82,22.51 79.12,23.21 79.12,31.72 75.56,35.27 51.94,35.27 49.91,37.3 v1(49.91,37.5)
  Bottom Layer w0.254: v1(49.91,41.9) v1(49.91,37.5)
I2C_SDA: length 60.2
  Top Layer w0.254: U6.23 47.18,45.25 49.02,43.4 v1(49.02,41.9) ; v1(49.02,37.5) 49.02,37.43 51.69,34.77 75.32,34.77 78.49,31.6 78.49,21.43 79.92,20 81.75,20 R38.1 86.5,20.25 J8.4
  Bottom Layer w0.254: v1(49.02,41.9) v1(49.02,37.5)
LATCH_ARM: length 2
  Top Layer w0.254: 33.27,52.42 33.31,52.47 U6.10
LATCH_STATE: length 6.2
  Top Layer w0.254: U6.9 34.24,53.73 31.17,56.81 U2.3
LOGIC_FB: length 12.7
  Top Layer w0.254: R35.2 10.68,65.88 10.67,65.89 9.14,65.89 9.14,65.88 8.7,65.88 4.44,61.63 4.44,59.91 3.75,59.22 U25.5
LOGIC_SW: length 6.2
  Top Layer w0.6: L1.2 10.47,61.55 10.03,61.12 U25.3
MOTOR_1A: length 4.8
  Top Layer w0.4: U9.2 18.03,23.45 16.76,22.19 16.2,22.19 15.75,21.74 L3.1
MOTOR_1A_J: length 12.7
  Top Layer w0.4: J2.1 12.89,12.92 15.88,12.92 16.89,13.94 16.89,15.21 15.5,16.6 15.5,19.47 L3.2
MOTOR_1B: length 3.7
  Top Layer w0.4: L4.1 18.8,21.81 19.33,22.34 U9.4
MOTOR_1B_J: length 11
  Top Layer w0.4: L4.2 19.04,19.47 19.04,16.61 17.53,15.09 17.53,13.68 15.47,11.63 J2.3
MOTOR_2A: length 4.6
  Top Layer w0.4: L5.1 23.37,21.79 22.97,22.19 22.55,22.19 21.28,23.46 21.28,24.62 U9.7
MOTOR_2A_J: length 10
  Top Layer w0.4: L5.2 23.61,19.47 23.61,16.61 22.16,15.15 22.16,12.48 23.01,11.63 J3.1
MOTOR_2B: length 3.7
  Top Layer w0.4: L6.1 20.32,21.94 19.97,22.28 U9.5
MOTOR_2B_J: length 14.3
  Top Layer w0.4: L6.2 20.07,19.47 20.07,16.6 21.46,15.21 21.46,12.16 23.11,10.51 25.27,10.51 26.39,11.62 J3.3
MOTOR_3A: length 4.8
  Top Layer w0.4: U10.2 42.53,23.44 41.28,22.19 40.64,22.19 40.39,21.94 L7.1
MOTOR_3A_J: length 13
  Top Layer w0.4: L7.2 40.01,19.34 40.01,16.47 41.34,15.14 41.34,13.75 40.51,12.92 37.08,12.92 36.09,11.93 J4.1
MOTOR_3B: length 3.7
  Top Layer w0.4: 43.82,24.63 43.82,22.46 43.43,22.06 43.43,21.12 L8.1
MOTOR_3B_J: length 11
  Top Layer w0.4: J4.3 40.11,11.63 42.04,13.56 42.04,15.21 43.55,16.72 43.55,19.6 L8.2
MOTOR_4A: length 5
  Top Layer w0.4: 48.03,21.1 48.03,21.92 47.75,22.19 46.86,22.19 45.78,23.28 U10.7
MOTOR_4A_J: length 10.1
  Top Layer w0.4: J5.1 47.33,11.63 46.74,12.22 46.74,15.08 48.25,16.6 48.25,19.49 L9.2
MOTOR_4B: length 3.7
  Top Layer w0.4: U10.5 44.45,24.6 44.45,22.45 44.93,21.97 44.93,21.1
MOTOR_4B_J: length 14.4
  Top Layer w0.4: L10.2 44.71,19.5 44.71,16.61 46.1,15.21 46.1,11.9 47.62,10.38 49.66,10.38 50.88,11.61 J5.3
MOTOR_5A: length 4.9
  Top Layer w0.4: L11.1 64.72,21.17 64.72,22.01 64.9,22.19 65.53,22.19 67.03,23.69 U11.2
MOTOR_5A_J: length 12.7
  Top Layer w0.4: L11.2 64.65,19.59 64.65,16.72 65.79,15.59 65.79,13.56 65.15,12.92 61.85,12.92 60.59,11.67 J6.1
MOTOR_5B: length 3.7
  Top Layer w0.4: 68.32,24.63 68.32,22.45 67.94,22.07 L12.1
MOTOR_5B_J: length 11.2
  Top Layer w0.4: L12.2 68.06,19.6 68.06,16.85 66.55,15.33 66.55,13.3 64.88,11.63 J6.3
MOTOR_6A: length 4.9
  Top Layer w0.4: U11.7 70.28,23.59 71.71,22.15 72.39,22.15 72.57,21.97 72.57,21.17 L13.1
MOTOR_6A_J: length 9.8
  Top Layer w0.4: J7.1 71.9,11.63 71.37,12.16 71.37,15.08 72.64,16.34 72.64,19.6 L13.2
MOTOR_6B: length 3.7
  Top Layer w0.4: U11.5 68.97,22.45 69.46,21.97 L14.1
MOTOR_6B_J: length 14.6
  Top Layer w0.4: L14.2 69.46,19 69.22,18.77 U23.1 69.22,16.74 69.22,16.73 69.22,16.48 70.61,15.08 70.61,11.78 72.14,10.25 74.01,10.25 J7.3
MOTOR_ADDR0: length 28.1
  Top Layer w0.254: U6.20 43.37,45.32 42.97,44.93 42.67,44.93 42.33,44.59 v1(42.33,44.29) ; 42.29,40.08 42.29,39.85 41.91,39.47 29.21,39.47 28.08,38.33 R26.2 28.02,36.72 27.23,36.72 27.05,36.54 27.05,34.77 27.43,34.39 U28.2
  Bottom Layer w0.254: v1(42.33,44.29) 42.33,40.05
  vias: v1(42.33,40.05)
MOTOR_ADDR1: length 28.9
  Top Layer w0.254: 26.48,34.71 26.04,35.15 R27.2 ; 26.48,34.71 27.45,33.74 U28.3 ; 26.48,34.71 26.54,34.77 26.54,37.43 29.16,40.05 v1(41.53,40.05) ; v1(41.53,44.29) 41.53,44.67 42.09,45.24 U6.19
  Bottom Layer w0.254: v1(41.53,44.29) v1(41.53,40.05)
MOTOR_ADDR2: length 21.4
  Top Layer w0.254: v1(43.94,44.29) 44.96,44.29 45.91,45.24 U6.22 ; 43.94,40.08 43.94,39.72 41.78,37.56 39.75,37.56 39.5,37.31 37.97,37.31 37.6,36.93 R28.2 36.8,36.29 36.7,36.19 36.7,34 35.79,33.09 U28.21
  Bottom Layer w0.254: v1(43.94,44.29) 43.94,40.05
  vias: v1(43.94,40.05)
MOTOR_ADDR3: length 20.8
  Top Layer w0.254: U6.21 44.63,45.24 44.32,44.93 43.56,44.93 43.14,44.5 v1(43.14,44.29) ; 43.18,40.02 43.18,39.72 42.44,38.98 37.45,38.98 37.22,38.75 37.22,38.32 R29.2 36.68,38.19 36.19,37.71 36.19,34.26 35.68,33.74 U28.22
  Bottom Layer w0.254: 43.14,44.29 v1(43.14,40.05)
MOTOR_ENABLE: length 12.3
  Top Layer w0.254: U6.11 35.23,51.22 32.2,51.22 31.12,50.13 28.23,50.13 27.72,50.64 27.72,51 Q1.1 R30.2 24.09,51.04
ONEWIRE_BUS: length 9.6
  Top Layer w0.254: J1.2 D1.1 R21.1 12.68,35.14
ONEWIRE_MCU: length 31.4
  Top Layer w0.254: v1(18.75,41.57) 13.83,36.65 R20.2 ; v1(18.75,44.1) 21.32,44.1 24.02,46.8 ; U6.12 31.8,49.92 31.54,49.67 v1(24,49.67)
  Bottom Layer w0.254: v1(24,46.8) v1(24,49.67) ; v1(18.75,41.57) v1(18.75,44.1)
REV1: length 19
  Top Layer w0.254: U28.5 24.68,32.44 22.99,34.13 16.38,34.13 15.62,33.37 15.62,32.1 16.13,31.59 17.72,31.59 18.03,31.28 U9.15
REV2: length 8.6
  Top Layer w0.254: U9.10 21.28,31.4 21.66,31.79 U28.6
REV3: length 10.1
  Top Layer w0.254: U10.15 42.53,31.36 42.29,31.59 41.66,31.59 38.6,28.54 U28.14
REV4: length 21.5
  Top Layer w0.254: U28.15 36.71,29.19 41.28,33.75 47.62,33.75 48.9,32.48 48.9,31.84 48.64,31.59 45.97,31.59 45.78,31.39 U10.10
REV5: length 36.6
  Top Layer w0.254: U28.18 34.84,31.08 36.71,31.08 40.91,35.27 48.01,35.27 51.56,31.72 66.55,31.72 67.03,31.24 U11.15
REV6: length 46.4
  Top Layer w0.254: U28.19 36.77,31.79 40.72,35.73 48.18,35.73 50.16,33.75 72.39,33.75 73.28,32.86 73.28,32.1 72.77,31.59 70.54,31.59 70.23,31.28 70.23,30.42 U11.10
STATUS_LED_A: length 2.7
  Top Layer w0.254: D3.1 18.51,60.89 18.92,61.31 19.55,61.31 R23.1
STATUS_LED_N: length 16.9
  Top Layer w0.254: U6.4 35.24,60.09 34.34,60.09 34.16,59.91 34.16,59.15 33.4,58.39 30.73,58.39 28.88,60.24 22.93,60.24 22.1,59.4 D3.2
TACHO_AC: length 2.8
  Top Layer w0.254: U5.3 66.58,55.35 C8.1 66.54,54.07
TACHO_AMP: length 17.1
  Top Layer w0.254: 68.13,57.25 67.82,57.56 67.82,58.76 R10.1 67.87,58.81 C10.2 67.87,62.16 R14.1 67.7,62.2 67.45,62.45 56.9,62.45 56.3,63.06 R13.2
TACHO_CMP: length 3.3
  Top Layer w0.254: R14.2 R15.1 69.33,64.48 ; U3.5 69.63,64.77 69.34,64.48
TACHO_FB: length 7.8
  Top Layer w0.254: C10.1 69.33,60.39 R10.2 69.47,58.63 69.47,55.72 69.84,55.35 U5.4 72.15,55.35 R8.2
TACHO_REF: length 28
  Top Layer w0.254: R8.1 73.64,55.33 v1(73.64,53.55) C9.2 71.36,53.69 R9.2 ; U3.6 71.75,66.64 76.95,61.44 R11.2 76.95,53.57 v1(76.96,53.56)
  Bottom Layer w0.254: v1(76.96,53.56) 73.66,53.56 v1(73.64,53.55)
UART_RX: length 3.4
  Top Layer w0.254: U6.36 53.55,58.81 54.53,57.83 54.53,56.62
UART_RX_DBG: length 52.8
  Top Layer w0.254: v1(53.47,41.9) 53.47,45.05 54.99,46.58 54.99,53.31 54.53,53.77 R40.2 ; J9.4 84,36.25 54.48,36.25 53.47,37.27 v1(53.47,37.5)
  Bottom Layer w0.254: v1(53.47,41.9) v1(53.47,37.5)
UART_TX: length 5.4
  Top Layer w0.254: U6.37 53.68,60.08 53.97,59.78 53.97,59.28 56.01,57.25 56.01,56.6
UART_TX_DBG: length 51
  Top Layer w0.254: R39.2 56.01,53.94 55.47,53.4 55.47,46.42 54.36,45.31 v1(54.36,41.9) ; v1(54.36,37.5) 54.36,37.14 54.76,36.73 85.76,36.73 86.31,36.19 86.44,36.19 J9.3
  Bottom Layer w0.254: 54.23,37.37 v1(54.36,37.5) v1(54.36,41.9)
USB_CC1: length 3.4
  Top Layer w0.254: USBC1.A5 7.79,49.64 8.92,50.77 9.79,50.77
USB_CC2: length 3.1
  Top Layer w0.254: USBC1.B5 8.31,46.64 9.02,45.94 R32.1
USB_DM: length 24.3
  Top Layer w0.254: U6.13 35.08,48.48 28.05,48.48 27.92,48.36 15.11,48.36 14.02,49.45 11.69,49.45 11.56,49.32
USB_DN_IN: length 6.1
  Top Layer w0.254: U27.1 8.32,49.43 8.03,49.14 USBC1.B7 5.85,49.14 5.58,48.88 5.58,48.4 5.84,48.14 USBC1.A7
USB_DP: length 24.2
  Top Layer w0.254: 11.56,47.42 11.6,47.39 35.79,47.39
USB_DP_IN: length 4.9
  Top Layer w0.254: USBC1.B6 7.98,47.64 ; 7.98,47.64 8.33,47.64 8.44,47.53 U27.3 ; 7.98,47.64 7.98,48.51 7.84,48.64 USBC1.A6
USB_ILIM: length 2.3
  Top Layer w0.254: 8.89,56.23 8.89,57.12 9.53,57.75 R34.1

## Copper pours and planes (outline as drawn; the poured copper is in the pictures)
3V3_MOTOR_REG on Top Layer: 68.59,45.32 69.49,45.32 69.49,44.13 68.59,44.13
GND on Top Layer: 0.5,71.5 89.5,71.5 89.5,0.5 0.5,0.5
GND on Bottom Layer: 0.5,71.5 89.5,71.5 89.5,0.5 0.5,0.5
VBUS_RAW on Top Layer: 7.54,53.93 8.34,53.93 8.34,52.61 7.54,52.61

Small or netless copper shapes (teardrops, artwork), in the pictures only: 554 on Top Layer, 86 on Bottom Layer

## Text on the board
Bottom Silkscreen Layer: LUNE-V6 / Rev 3.2-H / Birkemosen.  2026-08 | Development Board - NO WARRANTY
Top Silkscreen Layer: 3V3 LOGIC | VBUS PROTECTED | +3v3 | DATA | GND | Zone 1 | Zone 2 | Zone 3 | Zone 4 | Zone 5 | Zone 6 | SDA | SCL | TX | RX | UART | DISPLAY/I2C | One-Wire | Tacho Amp | Current | VBUS Protected | 3V3 Analog | 3V3 Motor | Floor Heating Controller | +3v3 Motors only | LUNE-V6
